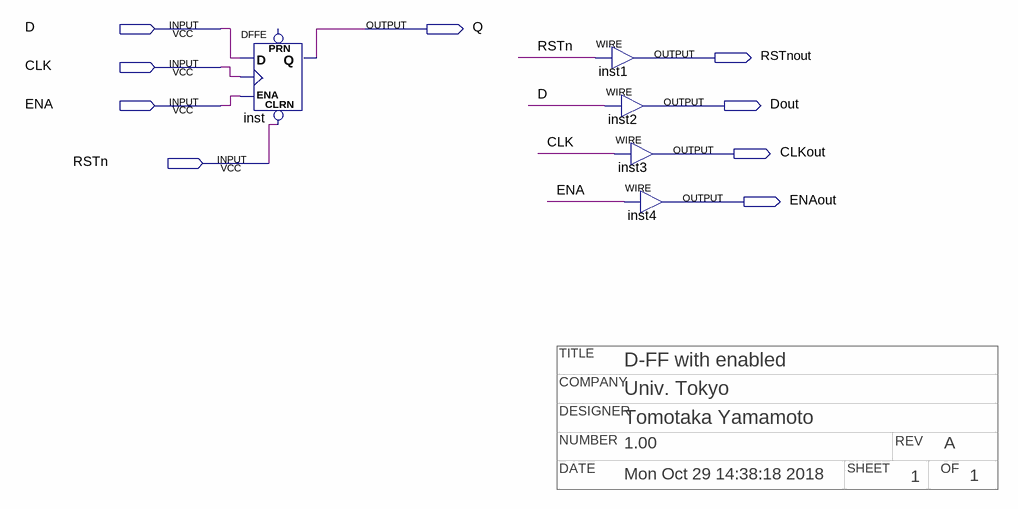
[diagram p0: schematic sheet]
// Quartus schematic a02_DEF.bdf as structural Verilog: 5 symbols, 9 pins
// Title block: COMPANY: Univ. Tokyo; DATE: Mon Oct 29 14:38:18 2018; DESIGNER: Tomotaka Yamamoto; NUMBER: 1.00; OF: 1; REV: A; SHEET: 1; TITLE: D-FF with enabled
module a02_DEF (
  input  D,
  input  CLK,
  input  ENA,
  input  RSTn,
  output Q,
  output RSTnout,
  output Dout,
  output CLKout,
  output ENAout
);

  DFFE inst (.CLRN(RSTn), .D(D), .CLK(CLK), .ENA(ENA), .Q(Q));  // open: PRN
  assign RSTnout = RSTn;  // WIRE inst1
  assign Dout = D;  // WIRE inst2
  assign CLKout = CLK;  // WIRE inst3
  assign ENAout = ENA;  // WIRE inst4
endmodule
